# EAGLE design Grove - Buzzer  v1.0 (EAGLE 5.10)
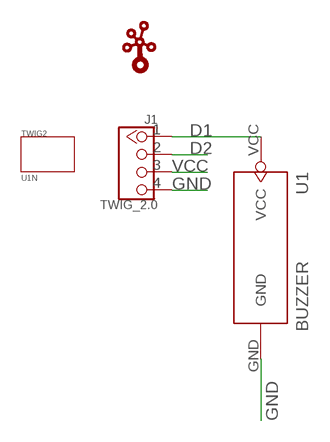
[diagram p0: schematic, sheet 1]

## Parts
J1  TWIG_2.0  [2.0_1X4]
TWIG2  U1N  [U1N]
U1  BUZZER  [BUZZER]
U$2  TWIGLOGOTWIGLOGO_SMALL  [TWIGLOGO_SMALL]

## Nets
D1: J1.1 U1.VCC
D2: J1.2
GND: J1.4 U1.GND
VCC: J1.3

## Library data of the parts
J1 = CONNECTER:TWIG_2.0
TWIG2 = twig_template1:U1N
U1 = AnlogDevice:BUZZER
U$2 = seeedleo:TWIGLOGO

## Board
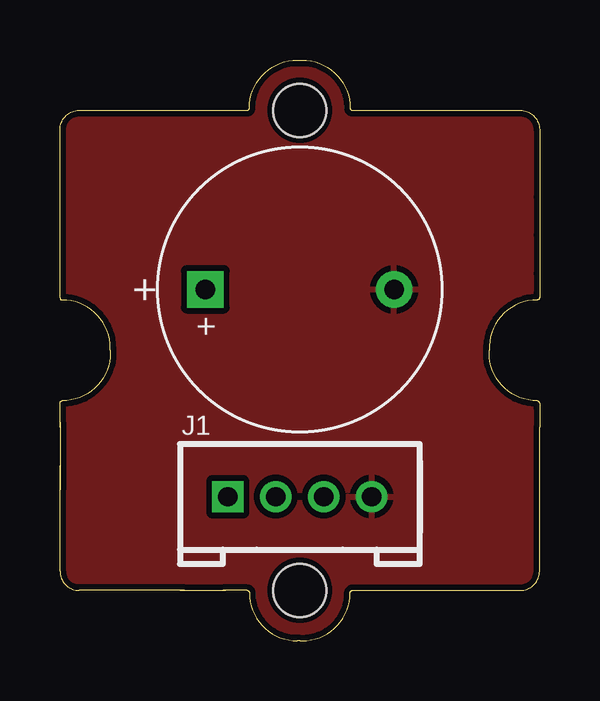
[diagram p1: board, top side]
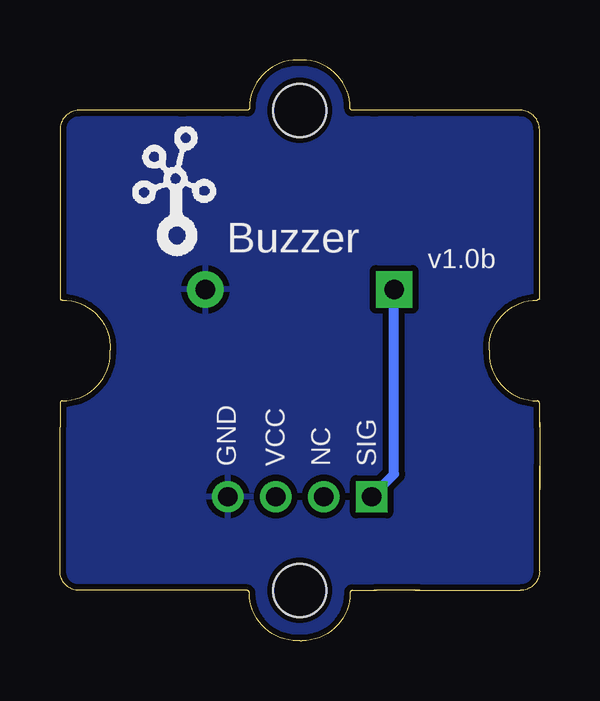
[diagram p2: board, bottom side, seen from below]

Size 20 x 24.2 mm. Coordinates in mm from the lower left corner, seen from the top.
Copper layers (1*16): Top 0.035mm / dielectric 1.5mm / Bottom 0.035mm
Design rules "SeeedStudio_rule_no_angle_090911": minimum track width 6mil, minimum drill 12mil, track to track 6mil, track to pad 6mil, pad to pad 6mil, via to via 6mil, smd to smd 0mil, copper to edge 10mil, drill to drill 10mil, minimum pad ring 10mil, minimum via ring 6mil, stop-mask expansion 2mil, vias tented up to drill 100mil, thermal gap 10mil

### Footprints (pad centres in the part's own frame; a part is rotated, then mirrored left to right if it is on the bottom)
2.0_1X4 = drill 0.8 pad 1.27 square: 1 -3,0 | drill 0.8 pad 1.27 round: 2 -1,0; 3 1,0; 4 3,0
U1N = hole 2.2: 0,-10; 0,10
BUZZER = drill 0.813 pad 1.524 round: GND 3.937,0 | drill 0.813 pad 1.524 square: VCC -3.937,0

### Placement (x,y rotation side)
J1  10,6 0 top
TWIG2  10,12.1 0 top
U1  10,14.64 0 top
U$2  17.37,15.91 0 bottom

### Tracks (layer width: path | path; a pad name or v marks a point on that pad's centre or on a via)
D1
  Bottom 0.406: U1.VCC 6.06,6.94 J1.1
GND
  pour Bottom (isolate 0.254): -0.16,25.05 20.16,25.05 20.16,-0.22 -0.16,-0.22
  pour Top (isolate 0.254): -0.16,25.05 20.16,25.05 20.16,-0.22 -0.16,-0.22

### Text on the board
tPlace: +
bPlace: v1.0b | Buzzer | SIG | NC | VCC | GND